# EAGLE design smartPowerStrip (EAGLE 8.6.3)
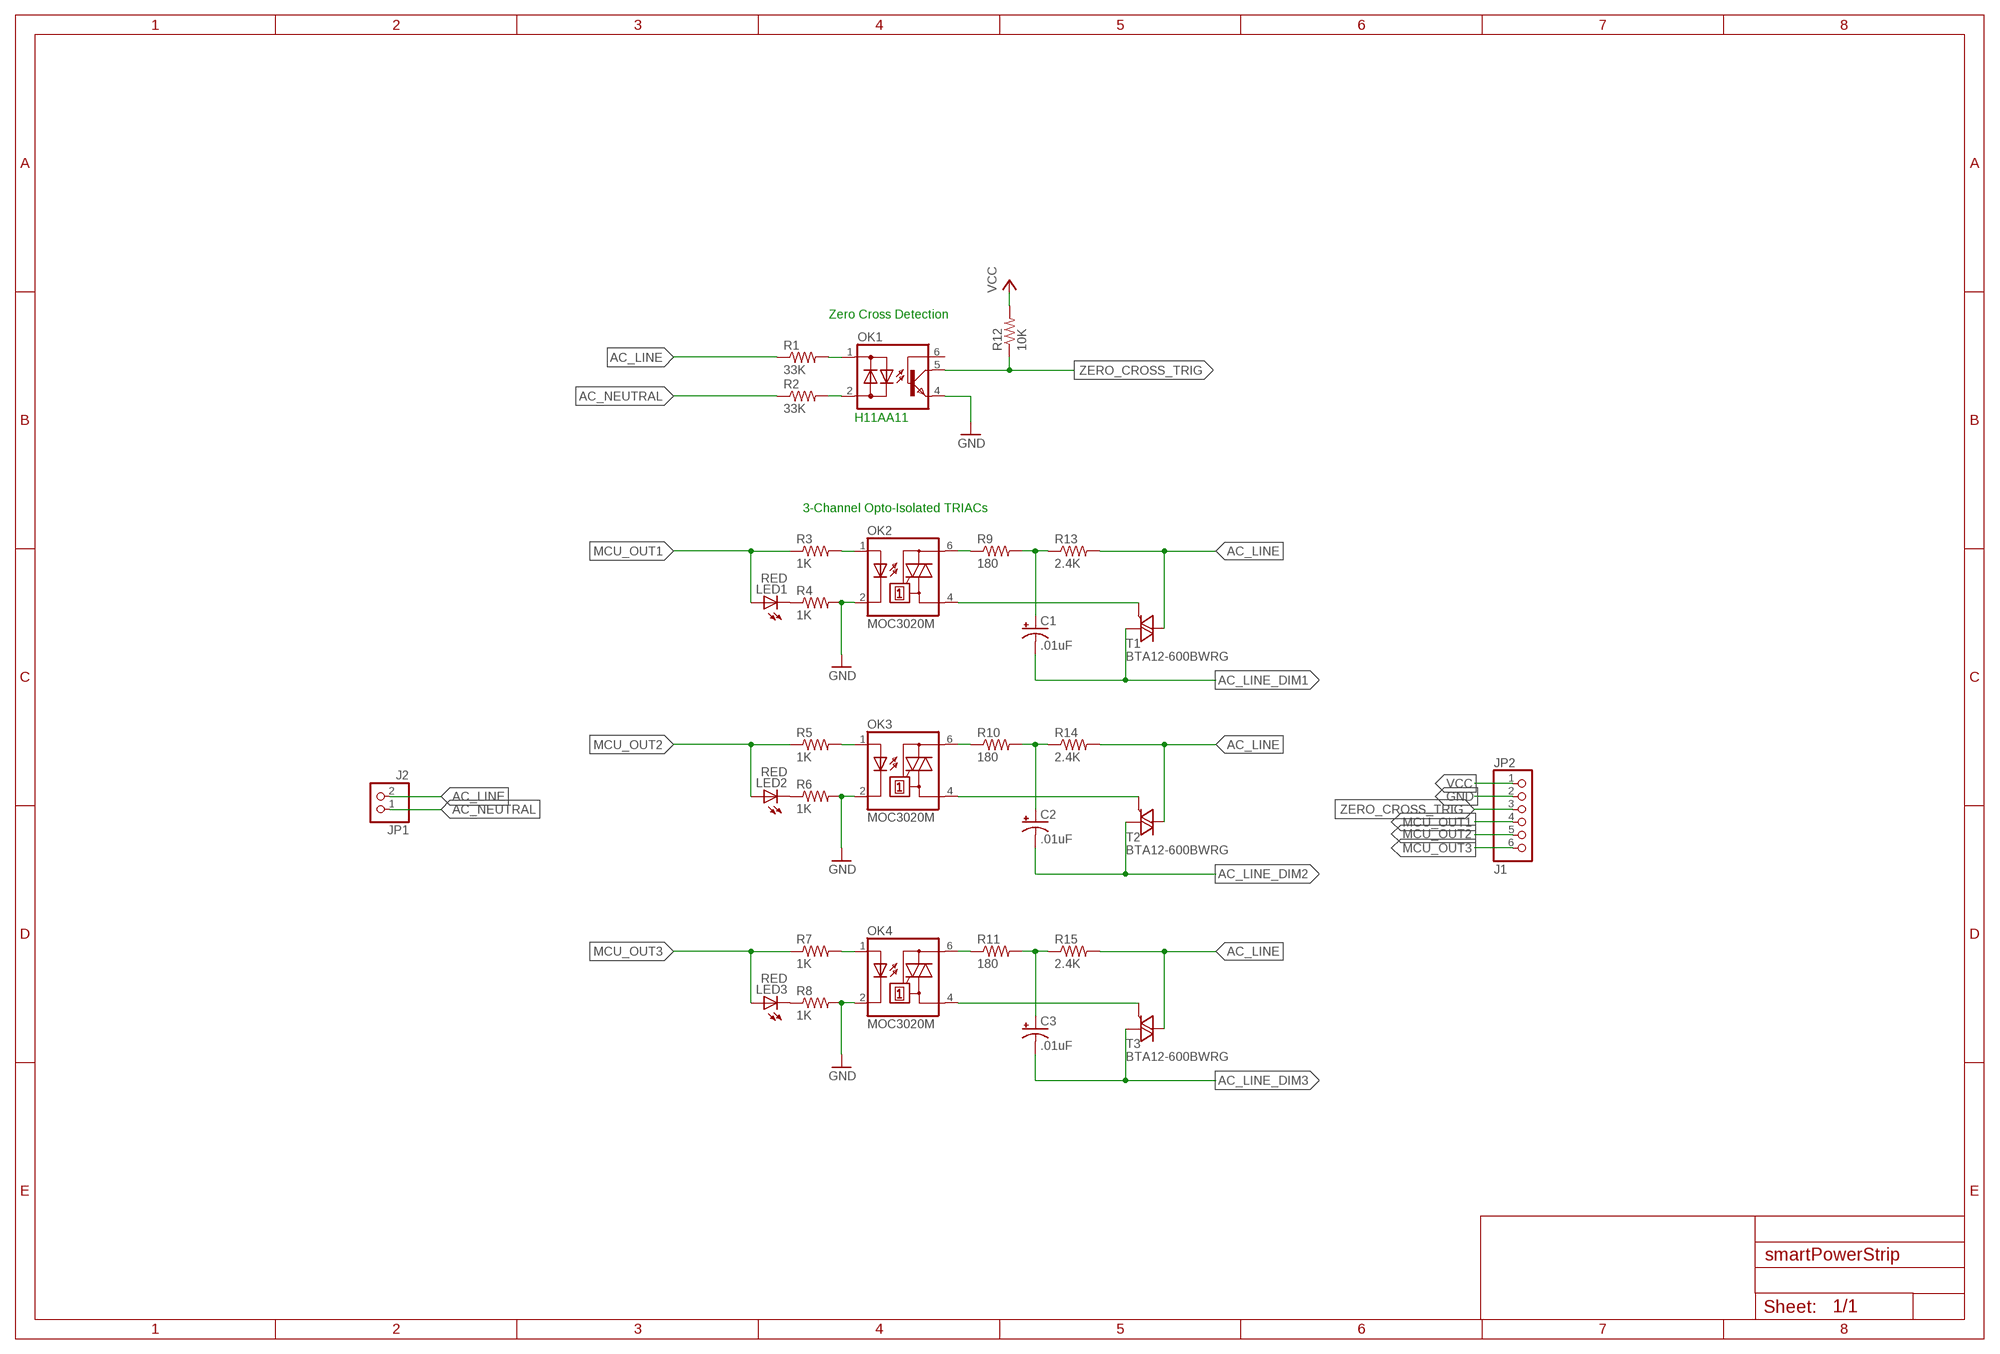
[diagram p0: schematic, sheet 1]

## Parts
C1  .01uF  CPOL-USTT2D5  [TT2D5]
C2  .01uF  CPOL-USTT2D5  [TT2D5]
C3  .01uF  CPOL-USTT2D5  [TT2D5]
JP1  J2  PINHD-1X2  [1X02]
JP2  J1  PINHD-1X6  [1X06]
LED1  RED  LEDSFH480  [SFH480]
LED2  RED  LEDSFH480  [SFH480]
LED3  RED  LEDSFH480  [SFH480]
OK1  IL250  [DIL06]
OK2  MOC3020M  [DIL06]
OK3  MOC3020M  [DIL06]
OK4  MOC3020M  [DIL06]
R1  33K  R-US_0207/10  [0207/10]
R2  33K  R-US_0207/10  [0207/10]
R3  1K  R-US_0309/V  [0309V]
R4  1K  R-US_0309/V  [0309V]
R5  1K  R-US_0309/V  [0309V]
R6  1K  R-US_0309/V  [0309V]
R7  1K  R-US_0309/V  [0309V]
R8  1K  R-US_0309/V  [0309V]
R9  180  R-US_0309/V  [0309V]
R10  180  R-US_0309/V  [0309V]
R11  180  R-US_0309/V  [0309V]
R12  10K  R-US_0207/10  [0207/10]
R13  2.4K  R-US_0309/V  [0309V]
R14  2.4K  R-US_0309/V  [0309V]
R15  2.4K  R-US_0309/V  [0309V]
T1  BTA12-600BWRG  BT138-V  [TO220BV]
T2  BTA12-600BWRG  BT138-V  [TO220BV]
T3  BTA12-600BWRG  BT138-V  [TO220BV]

## Nets
AC_LINE [ACLow]: JP1.2 R1.1 R13.2 R14.2 R15.2 T1.T2(A2) T2.T2(A2) T3.T2(A2)
AC_LINE_DIM1 [ACLow]: C1.- T1.T1(A1)
AC_LINE_DIM2 [ACLow]: C2.- T2.T1(A1)
AC_LINE_DIM3 [ACLow]: C3.- T3.T1(A1)
AC_NEUTRAL [ACLow]: JP1.1 R2.1
AC_OUT1: C1.+ R9.2 R13.1
AC_OUT2: C2.+ R10.2 R14.1
AC_OUT3: C3.+ R11.2 R15.1
GND: JP2.2 OK1.4(E) OK2.2(C) OK3.2(C) OK4.2(C) R4.2 R6.2 R8.2
MCU_OUT1: JP2.4 LED1.A R3.1
MCU_OUT2: JP2.5 LED2.A R5.1
MCU_OUT3: JP2.6 LED3.A R7.1
N$1: OK3.6(A2) R10.1
N$2 [ACLow]: OK2.6(A2) R9.1
N$3 [ACLow]: OK1.2(AC2) R2.2
N$4: OK1.1(AC1) R1.2
N$5: OK3.1(A) R5.2
N$6: OK2.1(A) R3.2
N$7 [ACLow]: OK2.4(A1) T1.G
N$8 [ACLow]: OK3.4(A1) T2.G
N$9: LED2.K(C) R6.1
N$10: OK4.6(A2) R11.1
N$11: OK4.1(A) R7.2
N$12: LED1.K(C) R4.1
N$13 [ACLow]: OK4.4(A1) T3.G
N$14: LED3.K(C) R8.1
VCC: JP2.1 R12.2
ZERO_CROSS_TRIG: JP2.3 OK1.5(C) R12.1
Unconnected: OK1.6(B)

## Notes on the sheet
- Zero Cross Detection
- H11AA11
- 3-Channel Opto-Isolated TRIACs

## Library data of the parts
C1-C3 = rcl:CPOL-US: POLARIZED CAPACITOR, American symbol
JP1 = pinhead:PINHD-1X2: PIN HEADER
JP2 = pinhead:PINHD-1X6: PIN HEADER
LED1-LED3 = led:LED: LED OSRAM: - CHIPLED LG R971, LG N971, LY N971, LG Q971, LY Q971, LO R971, LY R971 LH N974, LH R974 LS Q976, LO Q976, LY Q976 LO Q996 - Hyper CHIPLED LW Q18S LB Q993, LB Q99A, LB R99A - SideLED LS A670, LO A670, LY A670, LG A670, LP A670 LB A673, LV A673, LT A673, LW A673 LH A674 LY A675 LS A676, LA A676, LO A676, LY A676, LW A676 LS A679, LY A679, LG A679 - Hyper Micro SIDELED® LS Y876, LA Y876, LO Y876, LY Y876 LT Y87S - SmartLED LW L88C, LW L88S LB L89C, LB L89S, LG L890 LS L89K, LO L89K, LY L89K LS L896, LA L896, LO L896, LY L896 - TOPLED LS T670, LO T670, LY T670, LG T670, LP T670 LSG T670, LSP T670, LSY T670, LOP T670, LYG T670 LG T671, LOG T671, LSG T671 LB T673, LV T673, LT T673, LW T673 LH T674 LS T676, LA T676, LO T676, LY T676, LB T676, LH T676, LSB T676, LW T676 LB T67C, LV T67C, LT T67C, LS T67K, LO T67K, LY T67K, LW E67C LS E67B, LA E67B, LO E67B, LY E67B, LB E67C, LV E67C, LT E67C LW T67C LS T679, LY T679, LG T679 LS T770, LO T770, LY T770, LG T770, LP T770 LB T773, LV T773, LT T773, LW T773 LH T774 LS E675, LA E675, LY E675, LS T675 LS T776, LA T776, LO T776, LY T776, LB T776 LHGB T686 LT T68C, LB T68C - Hyper Mini TOPLED® LB M676 - Mini TOPLED Santana® LG M470 LS M47K, LO M47K, LY M47K Source: http://www.osram.convergy.de LUXEON: - LUMILED® LXK2-PW12-R00, LXK2-PW12-S00, LXK2-PW14-U00, LXK2-PW14-V00 LXK2-PM12-R00, LXK2-PM12-S00, LXK2-PM14-U00 LXK2-PE12-Q00, LXK2-PE12-R00, LXK2-PE12-S00, LXK2-PE14-T00, LXK2-PE14-U00 LXK2-PB12-K00, LXK2-PB12-L00, LXK2-PB12-M00, LXK2-PB14-N00, LXK2-PB14-P00, LXK2-PB14-Q00 LXK2-PR12-L00, LXK2-PR12-M00, LXK2-PR14-Q00, LXK2-PR14-R00 LXK2-PD12-Q00, LXK2-PD12-R00, LXK2-PD12-S00 LXK2-PH12-R00, LXK2-PH12-S00 LXK2-PL12-P00, LXK2-PL12-Q00, LXK2-PL12-R00 Source: www.luxeon.com KINGBRIGHT: KA-3528ASYC Source: www.kingbright.com
OK1 = optocoupler:IL250: SIEMENS OPTO COUPLER; MF: VISHAY/TELEFUNKEN; MPN: IL250; OC_FARNELL: 1469559; OC_NEWARK: 58K1705
OK2-OK4 = optocoupler:MOC30*M: RANDOM-PHASE OPTOISOLATORS TRIAC DRIVER OUTPUT Source: http://www.fairchildsemi.com MOC3020-M.pdf; MF: FAIRCHILD SEMICONDUCTOR; MPN: MOC3020-M; OC_FARNELL: 1505425; OC_NEWARK: 72K8895
R1-R15 = rcl:R-US_: RESISTOR, American symbol
T1-T3 = triac:BT138: TRIAC Source: http://www.semiconductors.philips.com BT138_SERIES_2.pdf

## Net classes
0 default: width 0.254 mm, drill 0.508 mm, clearance 0.305 mm
1 ACHigh: width 1.016 mm, drill 0.254 mm, clearance 0.508 mm
2 ACLow: width 0.508 mm, drill 0.508 mm, clearance 0.508 mm

## Board
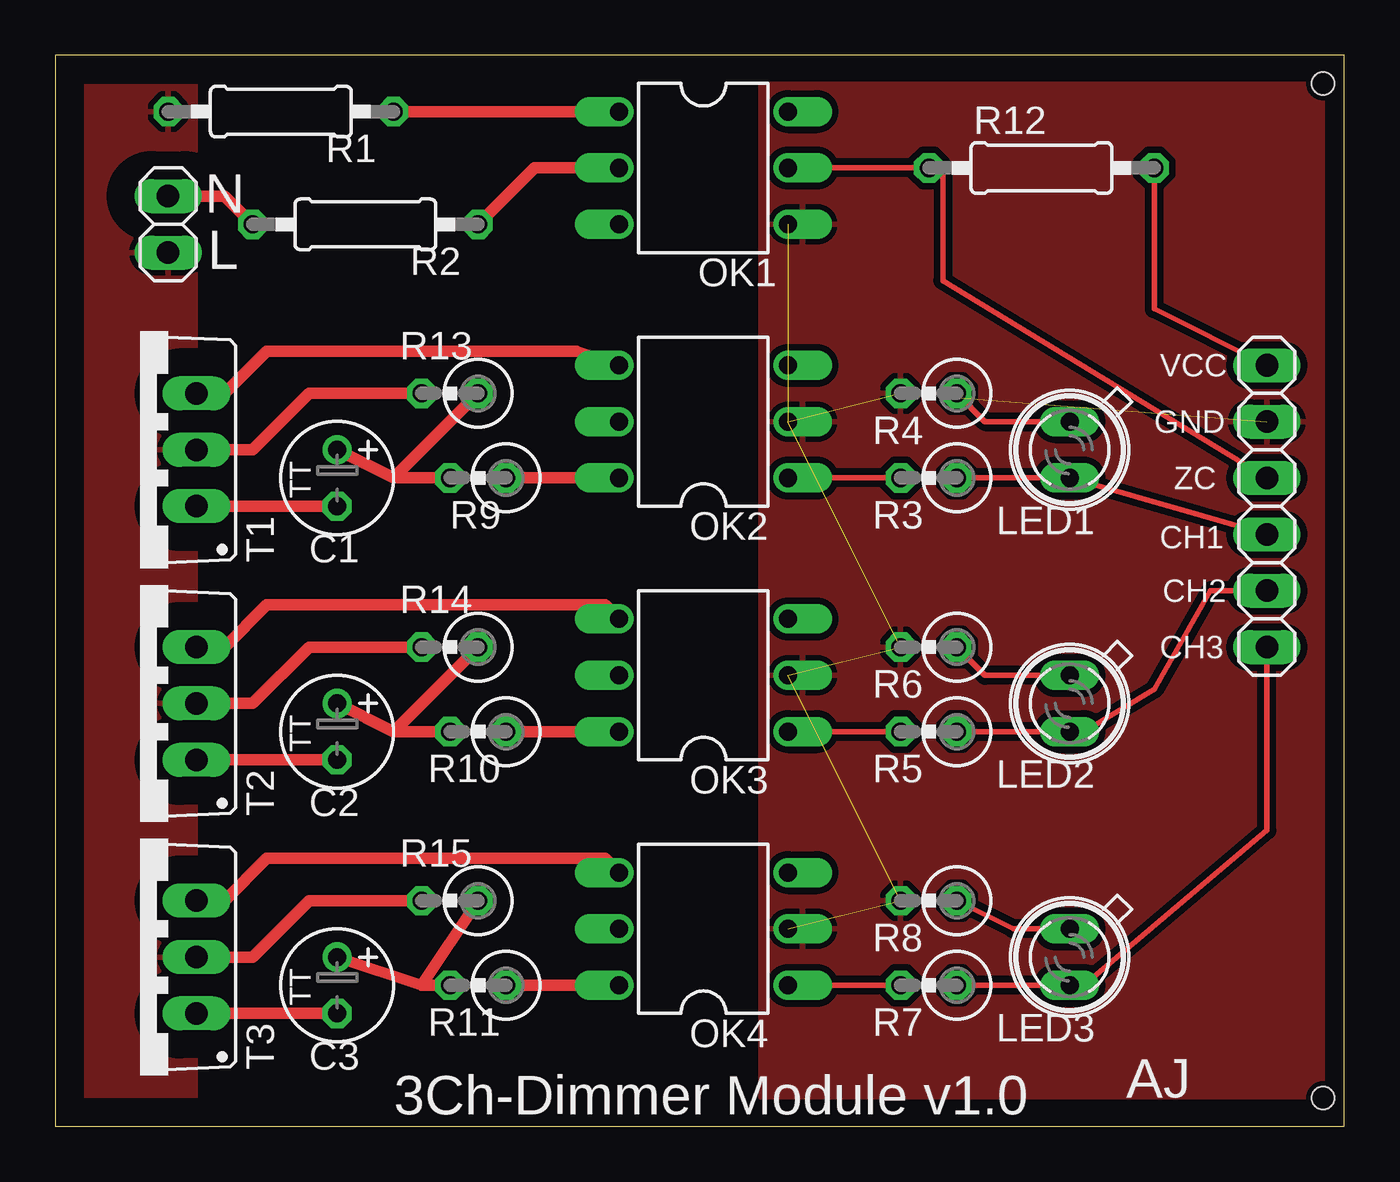
[diagram p1: board, top side]

Size 58.09 x 48.25 mm. Coordinates in mm from the lower left corner, seen from the top.
Outline: 0,0 58.09,0 58.09,48.25 0,48.25 0,0
Copper layers (1*16): Top 0.035mm / dielectric 1.5mm / Bottom 0.035mm
Design rules "default *": minimum track width 5mil, minimum drill 5mil, track to track 6mil, track to pad 6mil, pad to pad 6mil, via to via 6mil, smd to smd 6mil, copper to edge 10mil, drill to drill 25mil, minimum pad ring 10mil, minimum via ring 8mil, stop-mask expansion 4mil, vias tented up to drill 0mil, thermal gap 10mil
Holes 1 mm at 57.15,1.27 57.15,46.99

### Footprints (pad centres in the part's own frame; a part is rotated, then mirrored left to right if it is on the bottom)
TT2D5 = drill 0.813: + -1.27,0 | drill 0.813 octagon: - 1.27,0
1X02 = drill 1.016 long: 1 -1.27,0; 2 1.27,0
1X06 = drill 1.016 long: 1 -6.35,0; 2 -3.81,0; 3 -1.27,0; 4 1.27,0; 5 3.81,0; 6 6.35,0
SFH480 = drill 0.813 long: A 1.27,0; K -1.27,0
DIL06 = drill 0.813 offset: 1 -2.54,-3.81; 2 0,-3.81; 3 2.54,-3.81; 4 2.54,3.81; 5 0,3.81; 6 -2.54,3.81
0207/10 = drill 0.813 octagon: 1 -5.08,0; 2 5.08,0
0309V = drill 0.813 octagon: 1 -1.27,0; 2 1.27,0
TO220BV = drill 1.016 long: G 2.54,-2.54; T1 -2.54,-2.54; T2 0,-2.54

### Placement (x,y rotation side)
C1  12.7,29.21 270 top
C2  12.7,17.78 270 top
C3  12.7,6.35 270 top
JP1  5.08,40.64 270 top
JP2  54.61,27.94 270 top
LED1  45.72,30.48 270 top
LED2  45.72,19.05 270 top
LED3  45.72,7.62 270 top
OK1  29.21,43.18 270 top
OK2  29.21,31.75 90 top
OK3  29.21,20.32 90 top
OK4  29.21,8.89 90 top
R1  10.16,45.72 0 top
R2  13.97,40.64 0 top
R3  39.37,29.21 180 top
R4  39.37,33.02 180 top
R5  39.37,17.78 180 top
R6  39.37,21.59 180 top
R7  39.37,6.35 180 top
R8  39.37,10.16 180 top
R9  19.05,29.21 180 top
R10  19.05,17.78 180 top
R11  19.05,6.35 180 top
R12  44.45,43.18 0 top
R13  17.78,33.02 180 top
R14  17.78,21.59 180 top
R15  17.78,10.16 180 top
T1  3.81,30.48 90 top
T2  3.81,19.05 90 top
T3  3.81,7.62 90 top

### Tracks (layer width: path | path; a pad name or v marks a point on that pad's centre or on a via)
AC_LINE
  Top 0.508: T1.T2 8.89,30.48 11.43,33.02 R13.2 | R14.2 11.43,21.59 8.89,19.05 T2.T2 | R15.2 11.43,10.16 8.89,7.62 T3.T2
  pour Top (isolate 1.27): 1.27,46.99 1.27,1.27 6.35,1.27 6.35,46.99
AC_LINE_DIM1
  Top 0.508: C1.- T1.T1
AC_LINE_DIM2
  Top 0.508: C2.- T2.T1
AC_LINE_DIM3
  Top 0.508: C3.- T3.T1
AC_NEUTRAL
  Top 0.508: JP1.1 7.62,41.91 R2.1
AC_OUT1
  Top 0.508: 15.24,29.21 C1.+ | R9.2 15.24,29.21 | 15.24,29.21 R13.1
AC_OUT2
  Top 0.508: 15.24,17.78 C2.+ | R10.2 15.24,17.78 | 15.24,17.78 R14.1
AC_OUT3
  Top 0.508: 16.51,6.35 C3.+ | R11.2 16.51,6.35 | 16.51,6.35 R15.1
GND  (7 unrouted)
  pour Top: 31.75,46.99 31.75,1.27 57.15,1.27 57.15,46.99
MCU_OUT1
  Top 0.254: R3.1 LED1.A JP2.4
MCU_OUT2
  Top 0.254: R5.1 LED2.A 46.35,17.78 49.53,19.69 52.07,24.13 JP2.5
MCU_OUT3
  Top 0.254: R7.1 LED3.A 46.35,6.35 54.61,13.33 JP2.6
N$1
  Top 0.508: OK3.6 R10.1
N$2
  Top 0.508: OK2.6 R9.1
N$3
  Top 0.508: R2.2 21.59,43.18 OK1.2
N$4
  Top 0.508: OK1.1 R1.2
N$5
  Top 0.254: R5.2 OK3.1
N$6
  Top 0.254: R3.2 OK2.1
N$7
  Top 0.508: OK2.4 23.5,34.92 9.53,34.92 7.62,33.02 T1.G
N$8
  Top 0.508: OK3.4 24.77,23.49 9.53,23.49 7.62,21.59 T2.G
N$9
  Top 0.254: R6.1 41.91,20.32 LED2.K
N$10
  Top 0.508: OK4.6 R11.1
N$11
  Top 0.254: R7.2 OK4.1
N$12
  Top 0.254: R4.1 41.91,31.75 LED1.K
N$13
  Top 0.508: OK4.4 24.77,12.06 9.53,12.06 7.62,10.16 T3.G
N$14
  Top 0.254: R8.1 43.18,8.89 LED3.K
VCC
  Top 0.254: JP2.1 49.53,36.83 R12.2
ZERO_CROSS_TRIG
  Top 0.254: OK1.5 R12.1 40,43.18 40,38.1 JP2.3

### Text on the board
tSilk: N | L | VCC | GND | ZC | CH1 | CH2 | CH3 | AJ | 3Ch-Dimmer Module v1.0